# Altium schematic sheet DIGILATL INPUT.SchDoc
size A4
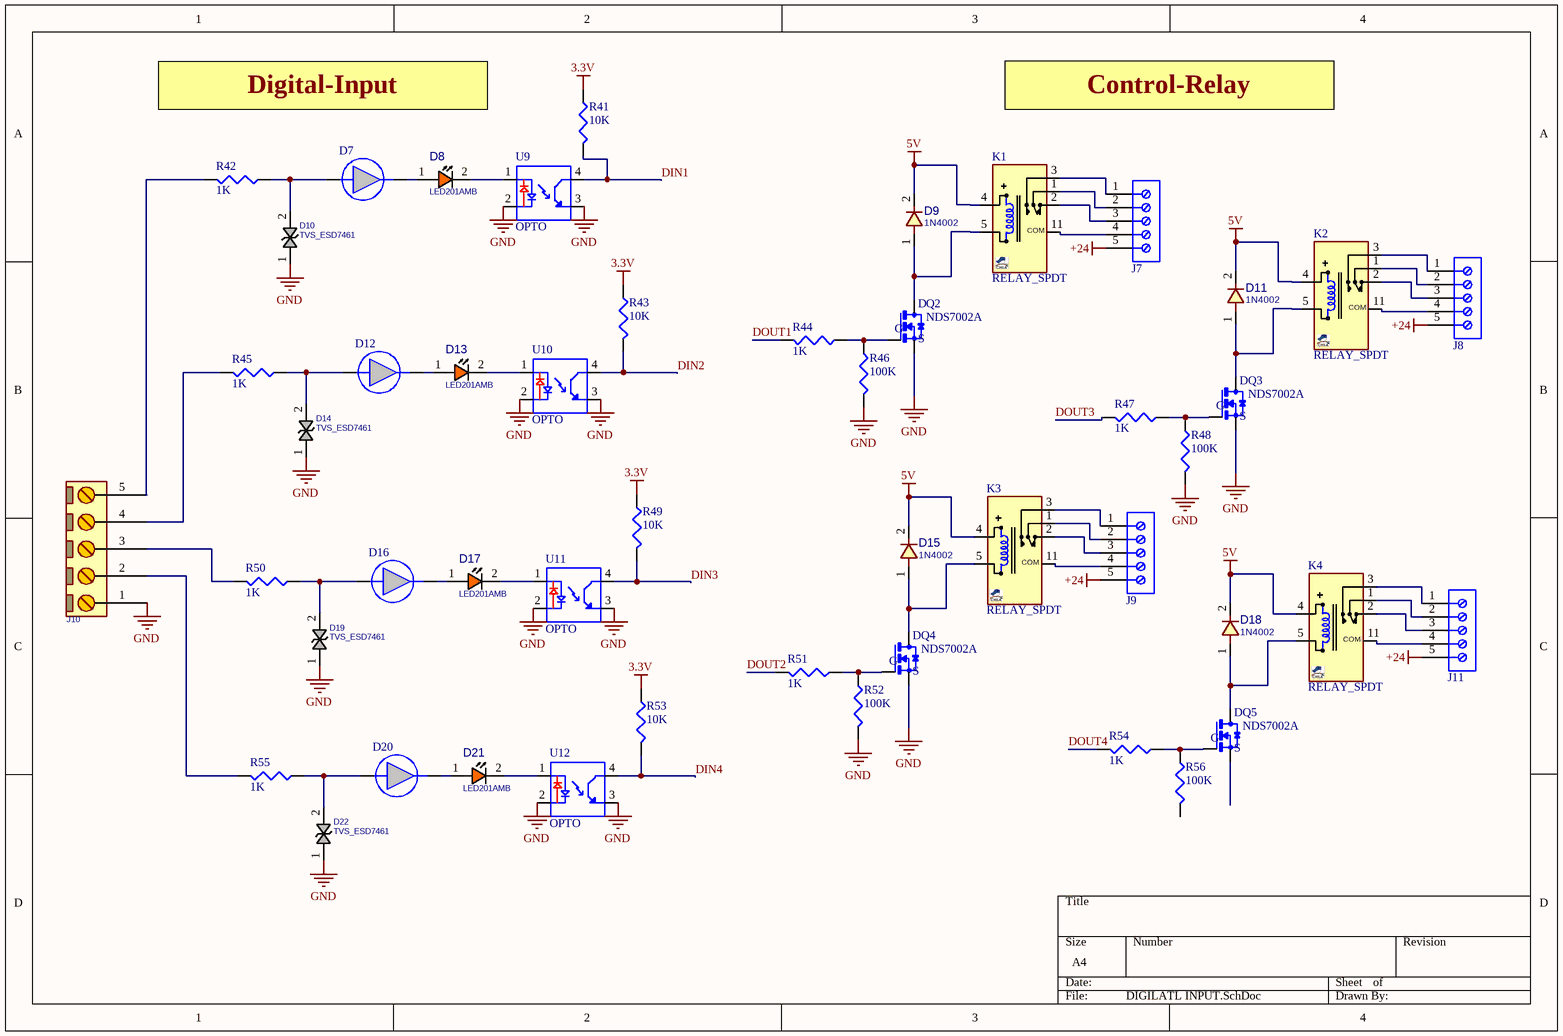
[diagram p0: DIGILATL INPUT.SchDoc]

## Parts
D7  NSI50010YT1G  [DRIVER-LED]  (value not drawn)
D8  LED201AMB  [LED0201AMB]
D9  1N4002  [D_SMA]
D10  TVS_ESD7461  [ESD_XDFN2]
D11  1N4002  [D_SMA]
D12  NSI50010YT1G  [DRIVER-LED]  (value not drawn)
D13  LED201AMB  [LED0201AMB]
D14  TVS_ESD7461  [ESD_XDFN2]
D15  1N4002  [D_SMA]
D16  NSI50010YT1G  [DRIVER-LED]  (value not drawn)
D17  LED201AMB  [LED0201AMB]
D18  1N4002  [D_SMA]
D19  TVS_ESD7461  [ESD_XDFN2]
D20  NSI50010YT1G  [DRIVER-LED]  (value not drawn)
D21  LED201AMB  [LED0201AMB]
D22  TVS_ESD7461  [ESD_XDFN2]
J7  691137710005  [CONN-RELAY]  (value not drawn)
J8  691137710005  [CONN-RELAY]  (value not drawn)
J9  691137710005  [CONN-RELAY]  (value not drawn)
J10  CONN_TB5  [MSTB_5]  (value not drawn)
J11  691137710005  [CONN-RELAY]  (value not drawn)
K1  RELAY_SPDT  [REL_SPDT_6_1611]
K2  RELAY_SPDT  [REL_SPDT_6_1611]
K3  RELAY_SPDT  [REL_SPDT_6_1611]
K4  RELAY_SPDT  [REL_SPDT_6_1611]
Q2  NDS7002A  [SOT23]
Q3  NDS7002A  [SOT23]
Q4  NDS7002A  [SOT23]
Q5  NDS7002A  [SOT23]
R41  10K  [0603L]
R42  1K  [0603L]
R43  10K  [0603L]
R44  1K  [0603L]
R45  1K  [0603L]
R46  value 100K  [0603L]  (hidden comment: 1K)
R47  1K  [0603L]
R48  value 100K  [0603L]  (hidden comment: 1K)
R49  10K  [0603L]
R50  1K  [0603L]
R51  1K  [0603L]
R52  value 100K  [0603L]  (hidden comment: 1K)
R53  10K  [0603L]
R54  1K  [0603L]
R55  1K  [0603L]
R56  value 100K  [0603L]  (hidden comment: 1K)
U9  OPTO  [SO_4]
U10  OPTO  [SO_4]
U11  OPTO  [SO_4]
U12  OPTO  [SO_4]

## Nets
3.3V: R41.1 R43.1 R49.1 R53.1
5V: D9.2 D11.2 D15.2 D18.2 K1.4(T1) K2.4(T1) K3.4(T1) K4.4(T1)
+24: J7.5 J8.5 J9.5 J11.5
GND: D10.1 D14.1 D19.1 D22.1 J10.1 Q2.2(S) Q3.2(S) Q4.2(S) R46.2 R48.2 R52.2 U9.2(C) U9.3(ET) U10.2(C) U10.3(ET) U11.2(C) U11.3(ET) U12.2(C) U12.3(ET)
DIN1: R41.2 U9.4(CT)
DIN2: R43.2 U10.4(CT)
DIN3: R49.2 U11.4(CT)
DIN4: R53.2 U12.4(CT)
DOUT1: R44.2
DOUT2: R51.2
DOUT3: R47.2
DOUT4: R54.2
NetD7_1: D7.1(K) D8.1(ANODE)
NetD7_2: D7.2(A) D10.2 R42.1
NetD8_2: D8.2(CATHODE) U9.1(A)
NetD9_1: D9.1 K1.5(T2) Q2.3(D)
NetD11_1: D11.1 K2.5(T2) Q3.3(D)
NetD12_1: D12.1(K) D13.1(ANODE)
NetD12_2: D12.2(A) D14.2 R45.1
NetD13_2: D13.2(CATHODE) U10.1(A)
NetD15_1: D15.1 K3.5(T2) Q4.3(D)
NetD16_1: D16.1(K) D17.1(ANODE)
NetD16_2: D16.2(A) D19.2 R50.1
NetD17_2: D17.2(CATHODE) U11.1(A)
NetD18_1: D18.1 K4.5(T2) Q5.3(D)
NetD20_1: D20.1(K) D21.1(ANODE)
NetD20_2: D20.2(A) D22.2 R55.1
NetD21_2: D21.2(CATHODE) U12.1(A)
NetJ7_1: J7.1 K1.3(NO)
NetJ7_2: J7.2 K1.1(COM)
NetJ7_3: J7.3 K1.2(NC)
NetJ7_4: J7.4 K1.11(COM)
NetJ8_1: J8.1 K2.3(NO)
NetJ8_2: J8.2 K2.1(COM)
NetJ8_3: J8.3 K2.2(NC)
NetJ8_4: J8.4 K2.11(COM)
NetJ9_1: J9.1 K3.3(NO)
NetJ9_2: J9.2 K3.1(COM)
NetJ9_3: J9.3 K3.2(NC)
NetJ9_4: J9.4 K3.11(COM)
NetJ10_2: J10.2 R55.2
NetJ10_3: J10.3 R50.2
NetJ10_4: J10.4 R45.2
NetJ10_5: J10.5 R42.2
NetJ11_1: J11.1 K4.3(NO)
NetJ11_2: J11.2 K4.1(COM)
NetJ11_3: J11.3 K4.2(NC)
NetJ11_4: J11.4 K4.11(COM)
NetQ2_1: Q2.1(G) R44.1 R46.1
NetQ3_1: Q3.1(G) R47.1 R48.1
NetQ4_1: Q4.1(G) R51.1 R52.1
NetQ5_1: Q5.1(G) R54.1 R56.1

Not connected (* = marked no-connect by the designer): Q5 2(S); R56 2

## Notes on the sheet
- Digital-Input
- Control-Relay

## Library data of the parts
D7 D12 D16 D20 = DRIVE-LED: Constant Current Regulator; Manufacturer_Name: onsemi; Geometry.Height: 1.35mm; Mouser Part Number: 863-NSI50010YT1G; Mouser Price/Stock: https://www.mouser.co.uk/ProductDetail/onsemi/NSI50010YT1G?qs=dubiLKbpNDpeXNVeIAV4bg%3D%3D; Manufacturer_Part_Number: NSI50010YT1G; Datasheet Link: http://www.onsemi.com/pub/Collateral/NSI50010Y-D.PDF
D8 D13 D17 D21 = LED_SMD_0201_AMB: LED, SMD, 0201, AMBER; PARAM: 20mA, 605nm, 140° Angle; MANF: Kingbright; DESC: DESCRIPTION; MANF_P#: APG0603SEC-TT; PARAM2: 2V, -40~85°C; ASSEMBLY: ASSEMBLY; PRICE: 0.5$; VALUE: LED201AMB
D9 D11 D15 D18 = DIODE_SMD_1N4002: DIODE, GENERAL PURPOSE, 100V/1A; DESC: DESCRIPTION; PARAM: 100V VRRM; PARAM2: 1A; MANF: MANF; ASSEMBLY: ASSEMBLY; PRICE: PRICE; MANF_P#: 1N4002; VALUE: 1N4002
D10 D14 D19 D22 = TVS_ESD7461: TVS, ESD PROTECT, Bidirectional; MANF_P#: ESD7461N2T5G; MANF: ON; PARAM: 16.5VB; PRICE: 0.5$; VALUE: TVS_ESD7461
J7-J9 J11 = CONN-RELAY: WR-TBL Series 1377 Horizontal Entry, THT, pitch 5mm, 5p; Manufacturer: Wurth Elektronik; Modularity: No; Rated Current: 16A; Working Voltage: 300V; ComponentLink1Description: Website Link; ComponentLink1URL: https://www.we-online.com/redexpert/article/691137710005?ad; ComponentLink2Description: Datasheet Link; ComponentLink2URL: https://www.we-online.com/redexpert/spec/691137710005?ad; Manufacturer Part Number: 691137710005; Category: Terminal Blocks; Match Code: WR-TBL; Mount: Through Hole; Operating Temperature Max: 120°C; Operating Temperature Min: -30°C; Packaging: Box; Application: Pressure Clamp; Number of Pins: 5; Number of Rows: 1; Orientation: Horizontal; Pitch: 5mm
J10 = CONN_MSTB_5: CONN, PHOENIX MSTB, 5-G, 5.08mm pitch; VALUE: CONN_TB5
K1-K4 = RELAY_SPDT_6_1611_TRB: Relay, SPDT, 5P, 15.5X11mm, TRB 125VAC/1A; MANF: TTI; MANF_P#: TRB-12VDC-A; PARAM2: 1A, 125VAC/30VDC; PARAM: 12V, 17mA, 720Ohm; PRICE: -; Value: RELAY_SPDT
Q2-Q5 = NDS7002A: NDS Series N-Channel 60 V 2 Ohm Enhancement Mode Field Effect Transistor SOT-23; MF: ON Semiconductor; Check_prices: https://www.snapeda.com/parts/NDS7002A/Onsemi/view-part/?ref=eda; Value: *; Availability: In Stock; MP: NDS7002A; Price: None; Package: SOT-23-3 ON Semiconductor; SnapEDA_Link: https://www.snapeda.com/parts/NDS7002A/Onsemi/view-part/?ref=snap; Purchase-URL: https://pricing.snapeda.com/search/part/NDS7002A/?ref=eda
R41 R43 R49 R53 = Res3: RES SMD 10K OHM 1% 1/10W 0603; Manufacturer Part Number: RC1608F103CS; Value: 10K; Digi-Key Part Number: 1276-3485-1-ND
R42 R44-R48 R50-R52 R54-R56 = Res3: RES SMD 1K OHM 1% 1/10W 0603; Manufacturer Part Number: RC1608F102CS; Published: 8-Jun-2000; LatestRevisionDate: 29-May-2009; LatestRevisionNote: IPC-7351 Footprint Added.; PackageReference: J1-0603; Publisher: Altium Limited; PackageDescription: Chip Resistor; Digi-Key Part Number: 1276-3484-1-ND
  R42 R44 R45 R47 R50 R51 R54 R55: Value: 1K
U9-U12 = OPTO: Optoisolator Transistor Output 3750Vrms 1 Channel 4-SOP; MP: TCMT1100; MF: Vishay Semiconductor; Digi-Key_Part_Number: TCMT1100CT-ND; Mouser-Purchase-URL: https://snapeda.com/shop?store=Mouser&id=286066; DigiKey-Purchase-URL: https://snapeda.com/shop?store=DigiKey&id=286066; Package: SOP-4 Vishay; SnapEDA_Link: https://www.snapeda.com/parts/TCMT1100/Vishay%20Semiconductor%20Opto%20Division/view-part/286066/?ref=snap; Value: *; Check_prices: https://www.snapeda.com/parts/TCMT1100/Vishay%20Semiconductor%20Opto%20Division/view-part/286066/?ref=eda